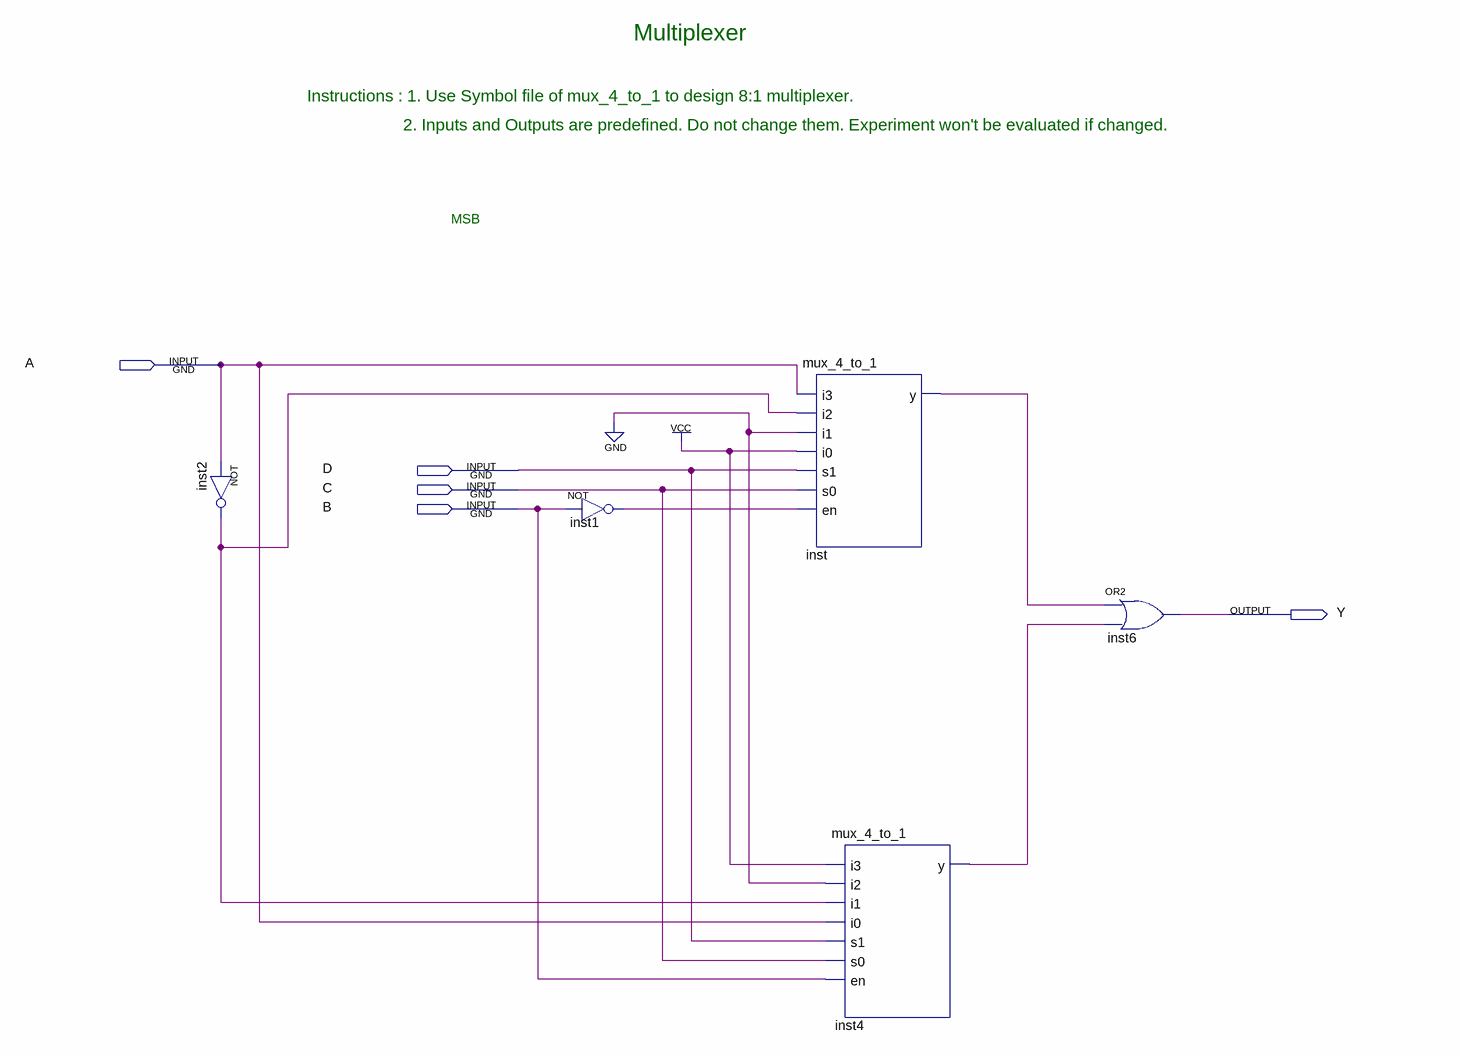
[diagram p0: schematic sheet]
// Quartus schematic mux_8_to_1.bdf as structural Verilog: 5 symbols, 5 pins
module mux_8_to_1 (
  input  A,
  input  D,
  input  C,
  input  B,
  output Y
);

  wire inst1_out, inst2_out, inst4_y, inst_y;

  not inst2 (inst2_out, A);
  not inst1 (inst1_out, B);
  mux_4_to_1 inst (.i3(A), .i2(inst2_out), .i1(1'b0), .i0(1'b1), .s1(D), .s0(C), .en(inst1_out), .y(inst_y));
  mux_4_to_1 inst4 (.i3(1'b1), .i2(1'b0), .i1(inst2_out), .i0(A), .s1(D), .s0(C), .en(B), .y(inst4_y));
  or inst6 (Y, inst_y, inst4_y);

  // Notes on the sheet:
  //   Multiplexer
  //   Instructions : 1. Use Symbol file of mux_4_to_1 to design 8:1 multiplexer. 
  //   2. Inputs and Outputs are predefined. Do not change them. Experiment won't be evaluated if changed.
  //   MSB
endmodule
